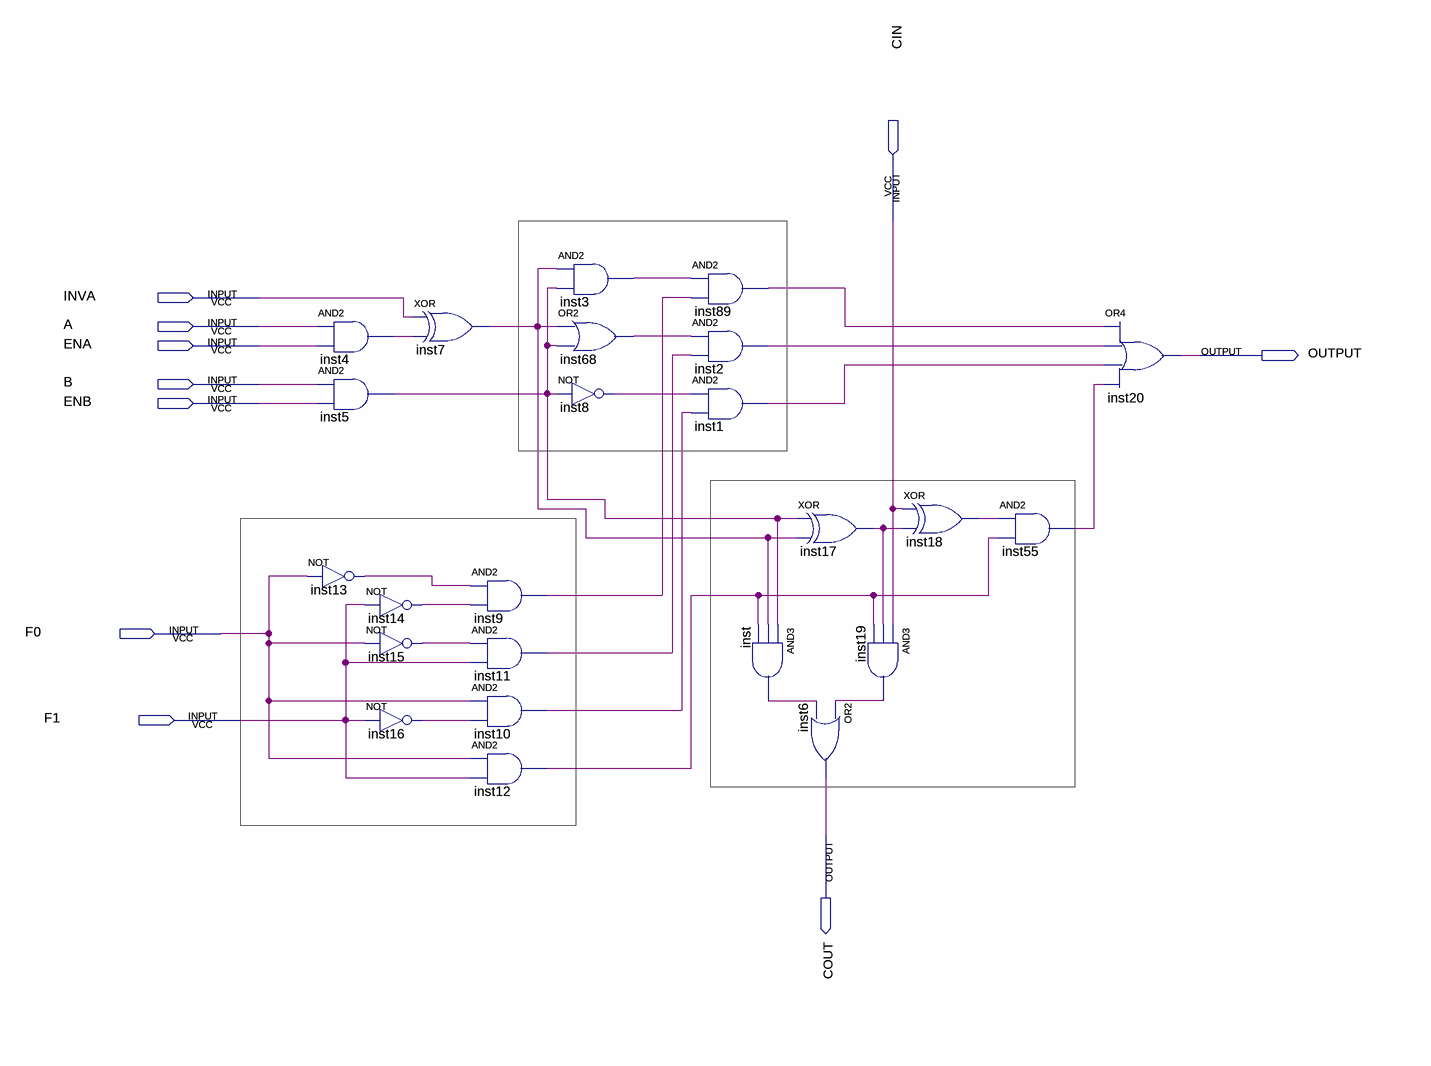
[diagram p0: schematic sheet]
// Quartus schematic ULA_1bit.bdf as structural Verilog: 48 symbols, 20 pins
module ULA_1bit (
  input  CIN,
  input  INVA,
  input  A,
  input  ENA,
  input  B,
  input  ENB,
  input  F0,
  input  F1,
  output OUTPUT,
  output COUT
);

  wire inst1_out, inst2_out, inst3_out, inst4_out, inst5_out, inst7_out, inst8_out, inst9_out, inst10_out,
       inst11_out, inst12_out, inst13_out, inst14_out, inst15_out, inst16_out, inst17_out, inst18_out,
       inst19_out, inst55_out, inst68_out, inst89_out, inst_out;

  and inst4 (inst4_out, A, ENA);
  and inst4_dup2 (inst4_out, A, ENA);
  and inst5 (inst5_out, B, ENB);
  and inst5_dup2 (inst5_out, B, ENB);
  not inst13 (inst13_out, F0);
  not inst13_dup2 (inst13_out, F0);
  xor inst7 (inst7_out, INVA, inst4_out);
  xor inst7_dup2 (inst7_out, INVA, inst4_out);
  not inst14 (inst14_out, F1);
  not inst14_dup2 (inst14_out, F1);
  not inst15 (inst15_out, F0);
  not inst15_dup2 (inst15_out, F0);
  not inst16 (inst16_out, F1);
  not inst16_dup2 (inst16_out, F1);
  and inst9 (inst9_out, inst13_out, inst14_out);
  and inst9_dup2 (inst9_out, inst13_out, inst14_out);
  and inst11 (inst11_out, inst15_out, F1);
  and inst11_dup2 (inst11_out, inst15_out, F1);
  and inst10 (inst10_out, F0, inst16_out);
  and inst10_dup2 (inst10_out, F0, inst16_out);
  and inst12 (inst12_out, F0, F1);
  and inst12_dup2 (inst12_out, F0, F1);
  and inst3 (inst3_out, inst7_out, inst5_out);
  and inst3_dup2 (inst3_out, inst7_out, inst5_out);
  or inst68 (inst68_out, inst7_out, inst5_out);
  or inst68_dup2 (inst68_out, inst7_out, inst5_out);
  not inst8 (inst8_out, inst5_out);
  not inst8_dup2 (inst8_out, inst5_out);
  and inst89 (inst89_out, inst3_out, inst9_out);
  and inst89_dup2 (inst89_out, inst3_out, inst9_out);
  and inst2 (inst2_out, inst68_out, inst11_out);
  and inst2_dup2 (inst2_out, inst68_out, inst11_out);
  and inst1 (inst1_out, inst8_out, inst10_out);
  and inst1_dup2 (inst1_out, inst8_out, inst10_out);
  xor inst17 (inst17_out, inst5_out, inst7_out);
  xor inst17_dup2 (inst17_out, inst5_out, inst7_out);
  and inst (inst_out, inst5_out, inst7_out, inst12_out);
  and inst_dup2 (inst_out, inst5_out, inst7_out, inst12_out);
  or inst6 (COUT, inst19_out, inst_out);
  or inst6_dup2 (COUT, inst19_out, inst_out);
  and inst19 (inst19_out, CIN, inst17_out, inst12_out);
  and inst19_dup2 (inst19_out, CIN, inst17_out, inst12_out);
  xor inst18 (inst18_out, CIN, inst17_out);
  xor inst18_dup2 (inst18_out, CIN, inst17_out);
  and inst55 (inst55_out, inst18_out, inst12_out);
  and inst55_dup2 (inst55_out, inst18_out, inst12_out);
  or inst20 (OUTPUT, inst89_out, inst2_out, inst1_out, inst55_out);
  or inst20_dup2 (OUTPUT, inst89_out, inst2_out, inst1_out, inst55_out);
endmodule
